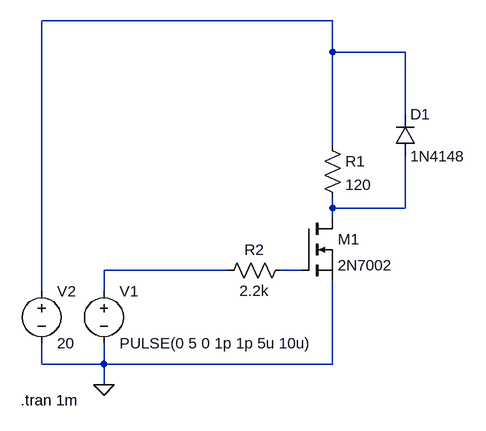
[diagram p0: schematic labor2_4_4RD.asc]
labor2_4_4RD.asc, the LTspice schematic file:
Version 4
SHEET 1 880 680
WIRE 256 -144 -192 -144
WIRE 256 -96 256 -144
WIRE 368 -96 256 -96
WIRE 368 0 368 -96
WIRE 256 48 256 -96
WIRE 256 144 256 128
WIRE 368 144 368 64
WIRE 368 144 256 144
WIRE 256 160 256 144
WIRE 96 240 -96 240
WIRE 208 240 176 240
WIRE -192 272 -192 -144
WIRE -96 272 -96 240
WIRE -192 384 -192 352
WIRE -96 384 -96 352
WIRE -96 384 -192 384
WIRE 256 384 256 256
WIRE 256 384 -96 384
WIRE -96 416 -96 384
FLAG -96 416 0
SYMBOL nmos 208 160 R0
SYMATTR InstName M1
SYMATTR Value 2N7002
SYMBOL res 240 32 R0
SYMATTR InstName R1
SYMATTR Value 120
SYMBOL res 80 256 R270
WINDOW 0 32 56 VTop 2
WINDOW 3 0 56 VBottom 2
SYMATTR InstName R2
SYMATTR Value 2.2k
SYMBOL voltage -96 256 R0
WINDOW 123 0 0 Left 2
WINDOW 39 0 0 Left 2
SYMATTR InstName V1
SYMATTR Value PULSE(0 5 0 1p 1p 5u 10u)
SYMBOL voltage -192 256 R0
WINDOW 123 0 0 Left 2
WINDOW 39 0 0 Left 2
SYMATTR InstName V2
SYMATTR Value 20
SYMBOL diode 352 64 M180
WINDOW 0 24 64 Left 2
WINDOW 3 24 0 Left 2
SYMATTR InstName D1
SYMATTR Value 1N4148
TEXT -224 440 Left 2 !.tran 1m

The netlist it stands for:
* labor2_4_4RD.asc
M1 N002 N004 0 0 2N7002
R1 N001 N002 120
R2 N003 N004 2.2k
V1 N003 0 PULSE(0 5 0 1p 1p 5u 10u)
V2 N001 0 20
D1 N002 N001 1N4148
.model D D
.lib standard.dio
.model NMOS NMOS
.model PMOS PMOS
.lib standard.mos
.tran 1m
.backanno
.end